# Altium schematic sheet [05] - REVISION HISTORY.SchDoc
size A3; Engineer: jpnbino; DocumentNumber: 5; SheetNumber: 5; SheetTotal: 6
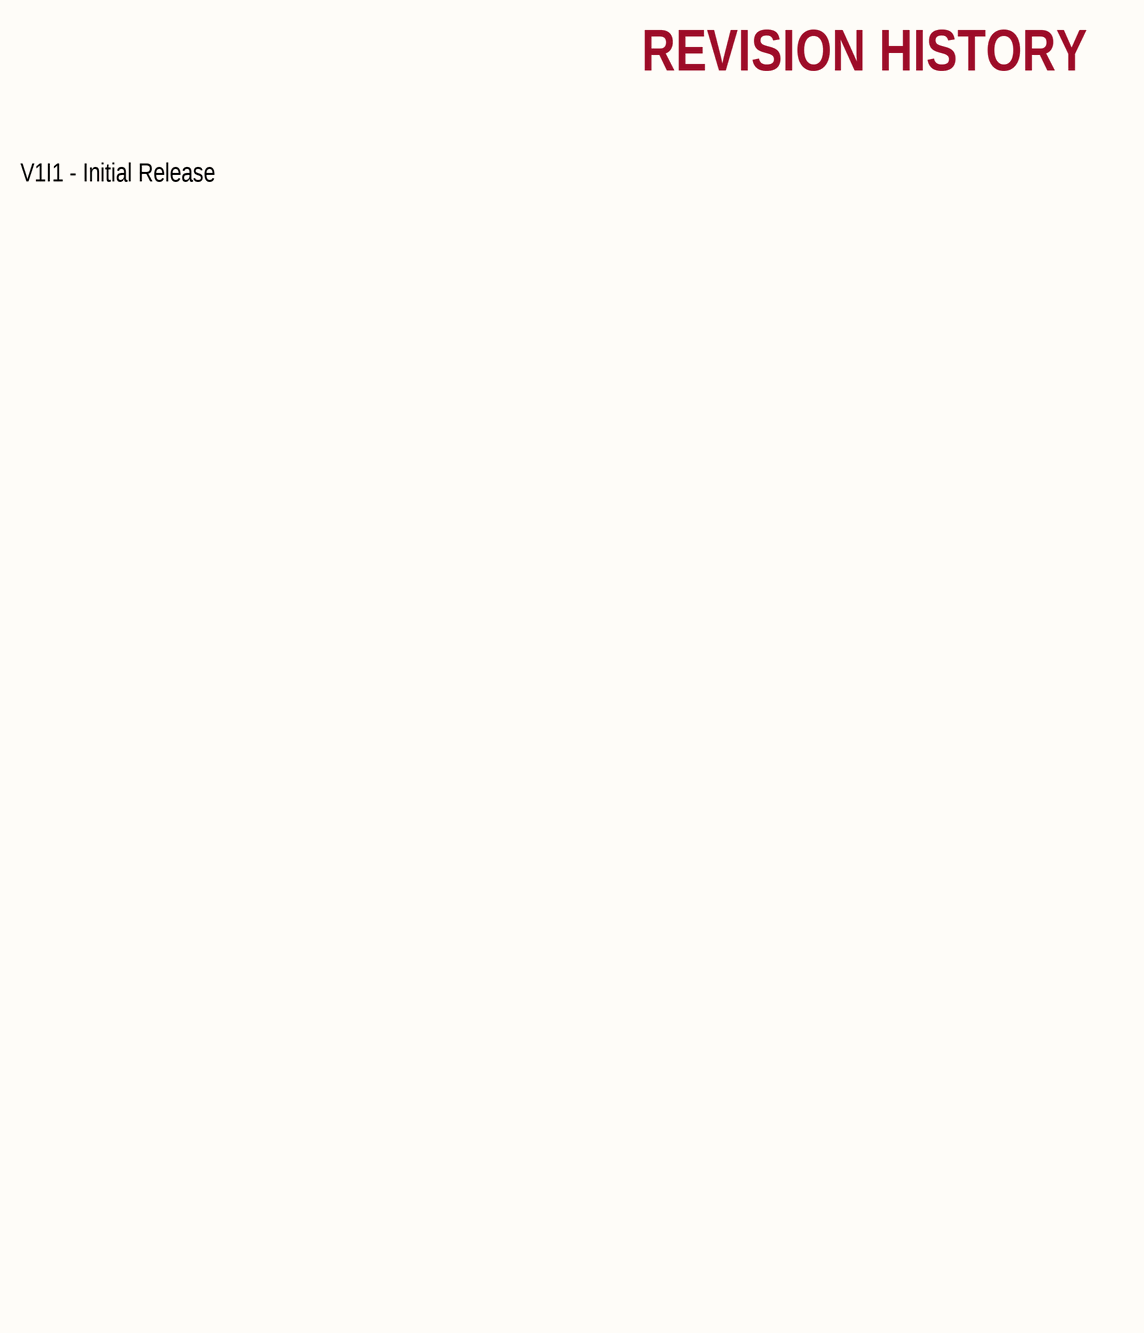
[diagram p0: [05] - REVISION HISTORY.SchDoc]

## Notes on the sheet
- REVISION HISTORY
- V1I1 - Initial Release
- CLOCKS (CPU & PCIE)
- Project:
- Revision:
- Engineer:
- Title:
- Pag
- of
- Date:
- Hour:
- Variant:
- Embedded Things